# Altium schematic sheet CYV15G0403.SchDoc: Cypress Molson - CYV15G0403
size B; CompanyName: Linear Systems Ltd.; DrawnBy: G. Cosens; Engineer: G. Cosens; Organization: Linear Systems Ltd.; Address1: 1717 Dublin Avenue, Unit 1; Address2: Winnipeg, MB, Canada; Address3: R3H 0H2; DocumentNumber: LS7652; Revision: 1; SheetNumber: 08; SheetTotal: 12
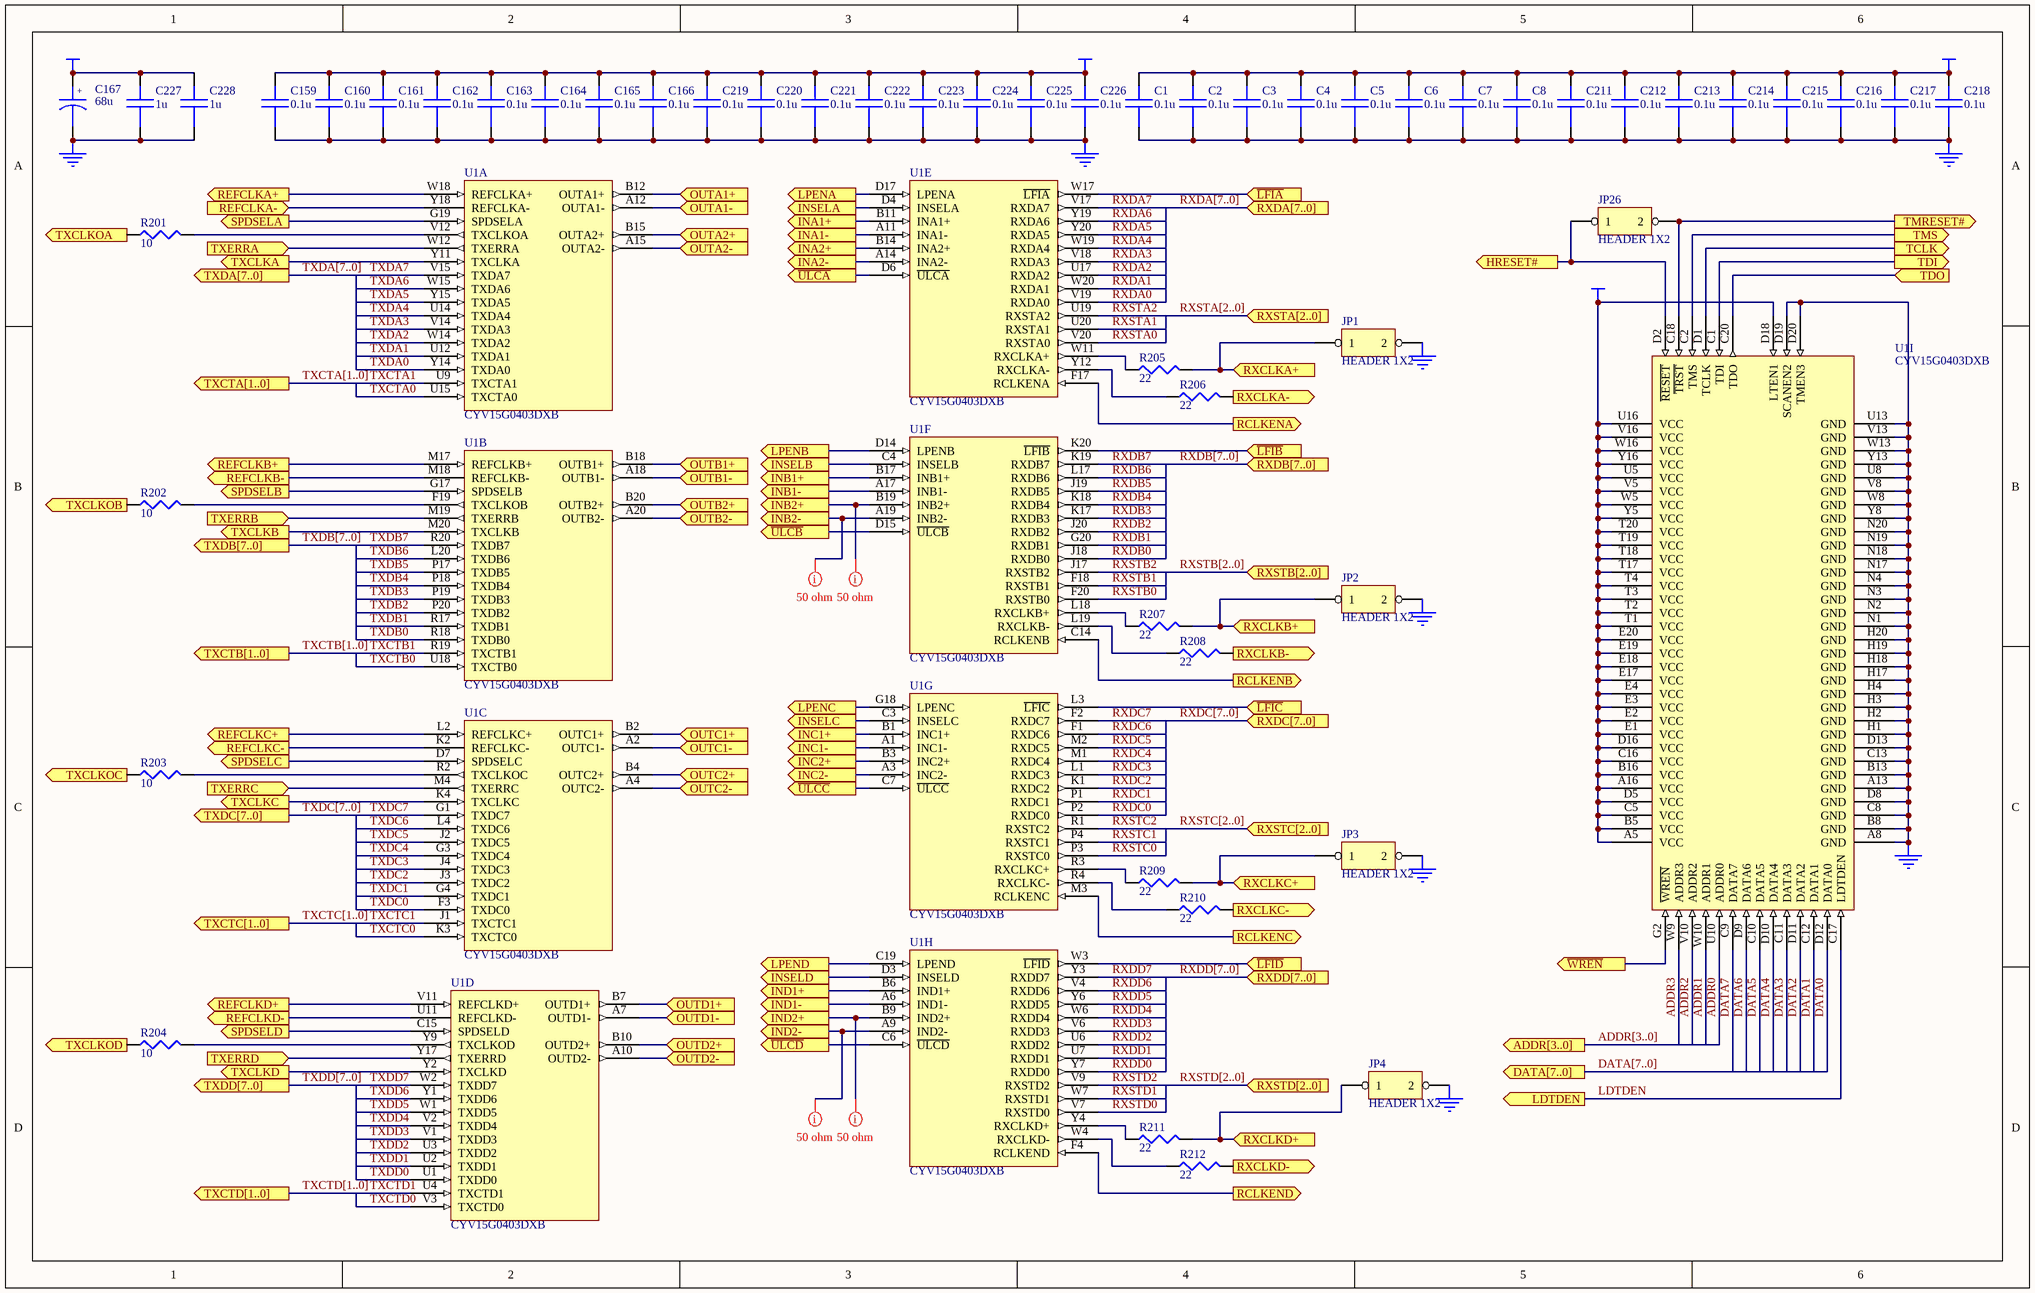
[diagram p0: CYV15G0403.SchDoc]

## Parts
C1  (no value)  [0603]
C2  (no value)  [0603]
C3  (no value)  [0603]
C4  (no value)  [0603]
C5  (no value)  [0603]
C6  (no value)  [0603]
C7  (no value)  [0603]
C8  (no value)  [0603]
C159  (no value)  [0603]
C160  (no value)  [0603]
C161  (no value)  [0603]
C162  (no value)  [0603]
C163  (no value)  [0603]
C164  (no value)  [0603]
C165  (no value)  [0603]
C166  (no value)  [0603]
C167  68u  [6032]
C211  (no value)  [0603]
C212  (no value)  [0603]
C213  (no value)  [0603]
C214  (no value)  [0603]
C215  (no value)  [0603]
C216  (no value)  [0603]
C217  (no value)  [0603]
C218  (no value)  [0603]
C219  (no value)  [0603]
C220  (no value)  [0603]
C221  (no value)  [0603]
C222  (no value)  [0603]
C223  (no value)  [0603]
C224  (no value)  [0603]
C225  (no value)  [0603]
C226  (no value)  [0603]
C227  (no value)  [0805]
C228  (no value)  [0805]
JP1  (no value)  [1X2PIN]
JP2  (no value)  [1X2PIN]
JP3  (no value)  [1X2PIN]
JP4  (no value)  [1X2PIN]
JP26  (no value)  [1X2PIN]
R201  10  [0603]
R202  10  [0603]
R203  10  [0603]
R204  10  [0603]
R205  22  [0603]
R206  22  [0603]
R207  22  [0603]
R208  22  [0603]
R209  22  [0603]
R210  22  [0603]
R211  22  [0603]
R212  22  [0603]
U1  CYV15G0403DXB  [BGA27X27-B256]  (parts A,B,C,D,E,F,G,H,I of 9)

## Ports
ADDR[3..0] (out), DATA[7..0] (out), HRESET# (out), INA1+ (out), INA1- (out), INA2+ (out), INA2- (out), INB1+ (out), INB1- (out), INB2+ (out), INB2- (out), INC1+ (out), INC1- (out), INC2+ (out), INC2- (out), IND1+ (out), IND1- (out), IND2+ (out), IND2- (out), INSELA (out), INSELB (out), INSELC (out), INSELD (out), LDTDEN (out), LPENA (out), LPENB (out), LPENC (out), LPEND (out), OUTA1+ (in), OUTA1- (in), OUTA2+ (in), OUTA2- (in), OUTB1+ (in), OUTB1- (in), OUTB2+ (in), OUTB2- (in), OUTC1+ (in), OUTC1- (in), OUTC2+ (in), OUTC2- (in), OUTD1+ (in), OUTD1- (in), OUTD2+ (in), OUTD2- (in), RCLKENA (out), RCLKENB (out), RCLKENC (out), RCLKEND (out), REFCLKA+ (out), REFCLKA- (in), REFCLKB+ (out), REFCLKB- (out), REFCLKC+ (out), REFCLKC- (out), REFCLKD+ (out), REFCLKD- (out), RXCLKA+ (in), RXCLKA- (in), RXCLKB+ (in), RXCLKB- (in), RXCLKC+ (in), RXCLKC- (in), RXCLKD+ (in), RXCLKD- (in), RXDA[7..0] (in), RXDB[7..0] (in), RXDC[7..0] (in), RXDD[7..0] (in), RXSTA[2..0] (in), RXSTB[2..0] (in), RXSTC[2..0] (in), RXSTD[2..0] (in), SPDSELA (out), SPDSELB (out), SPDSELC (out), SPDSELD (out), TCLK (out), TDI (out), TDO (in), TMRESET# (out), TMS (out), TXCLKA (out), TXCLKB (out), TXCLKC (out), TXCLKD (out), TXCLKOA (in), TXCLKOB (in), TXCLKOC (in), TXCLKOD (in), TXCTA[1..0] (out), TXCTB[1..0] (out), TXCTC[1..0] (out), TXCTD[1..0] (out), TXDA[7..0] (out), TXDB[7..0] (out), TXDC[7..0] (out), TXDD[7..0] (out), TXERRA (in), TXERRB (in), TXERRC (in), TXERRD (in), ~{LFIA} (in), ~{LFIB} (in), ~{LFIC} (in), ~{LFID} (in), ~{ULCA} (out), ~{ULCB} (out), ~{ULCC} (out), ~{ULCD} (out), ~{WREN} (out)

## Nets
+3.3V: C1.1 C2.1 C3.1 C4.1 C5.1 C6.1 C7.1 C8.1 C159.1 C160.1 C161.1 C162.1 C163.1 C164.1 C165.1 C166.1 C167.1 C211.1 C212.1 C213.1 C214.1 C215.1 C216.1 C217.1 C218.1 C219.1 C220.1 C221.1 C222.1 C223.1 C224.1 C225.1 C226.1 C227.1 C228.1 U1.A5(VCC) U1.A16(VCC) U1.B5(VCC) U1.B16(VCC) U1.C5(VCC) U1.C16(VCC) U1.D5(VCC) U1.D16(VCC) U1.D18(LTEN1) U1.E1(VCC) U1.E2(VCC) U1.E3(VCC) U1.E4(VCC) U1.E17(VCC) U1.E18(VCC) U1.E19(VCC) U1.E20(VCC) U1.T1(VCC) U1.T2(VCC) U1.T3(VCC) U1.T4(VCC) U1.T17(VCC) U1.T18(VCC) U1.T19(VCC) U1.T20(VCC) U1.U5(VCC) U1.U16(VCC) U1.V5(VCC) U1.V16(VCC) U1.W5(VCC) U1.W16(VCC) U1.Y5(VCC) U1.Y16(VCC)
GND: C1.2 C2.2 C3.2 C4.2 C5.2 C6.2 C7.2 C8.2 C159.2 C160.2 C161.2 C162.2 C163.2 C164.2 C165.2 C166.2 C167.2 C211.2 C212.2 C213.2 C214.2 C215.2 C216.2 C217.2 C218.2 C219.2 C220.2 C221.2 C222.2 C223.2 C224.2 C225.2 C226.2 C227.2 C228.2 JP1.2 JP2.2 JP3.2 JP4.2 U1.A8(GND) U1.A13(GND) U1.B8(GND) U1.B13(GND) U1.C8(GND) U1.C13(GND) U1.D8(GND) U1.D13(GND) U1.D19(SCANEN2) U1.D20(TMEN3) U1.H1(GND) U1.H2(GND) U1.H3(GND) U1.H4(GND) U1.H17(GND) U1.H18(GND) U1.H19(GND) U1.H20(GND) U1.N1(GND) U1.N2(GND) U1.N3(GND) U1.N4(GND) U1.N17(GND) U1.N18(GND) U1.N19(GND) U1.N20(GND) U1.U8(GND) U1.U13(GND) U1.V8(GND) U1.V13(GND) U1.W8(GND) U1.W13(GND) U1.Y8(GND) U1.Y13(GND)
ADDR0: U1.U10(ADDR0)
ADDR1: U1.W10(ADDR1)
ADDR2: U1.V10(ADDR2)
ADDR3: U1.W9(ADDR3)
DATA0: U1.D12(DATA0)
DATA1: U1.C12(DATA1)
DATA2: U1.D11(DATA2)
DATA3: U1.C11(DATA3)
DATA4: U1.D10(DATA4)
DATA5: U1.C10(DATA5)
DATA6: U1.D9(DATA6)
DATA7: U1.C9(DATA7)
HRESET#: JP26.1 U1.D2(~{RESET}) ; port HRESET#
INA1+: U1.B11(INA1+) ; port INA1+
INA1-: U1.A11(INA1-) ; port INA1-
INA2+: U1.B14(INA2+) ; port INA2+
INA2-: U1.A14(INA2-) ; port INA2-
INB1+: U1.B17(INB1+) ; port INB1+
INB1-: U1.A17(INB1-) ; port INB1-
INB2+: U1.B19(INB2+) ; port INB2+
INB2-: U1.A19(INB2-) ; port INB2-
INC1+: U1.B1(INC1+) ; port INC1+
INC1-: U1.A1(INC1-) ; port INC1-
INC2+: U1.B3(INC2+) ; port INC2+
INC2-: U1.A3(INC2-) ; port INC2-
IND1+: U1.B6(IND1+) ; port IND1+
IND1-: U1.A6(IND1-) ; port IND1-
IND2+: U1.B9(IND2+) ; port IND2+
IND2-: U1.A9(IND2-) ; port IND2-
INSELA: U1.D4(INSELA) ; port INSELA
INSELB: U1.C4(INSELB) ; port INSELB
INSELC: U1.C3(INSELC) ; port INSELC
INSELD: U1.D3(INSELD) ; port INSELD
~{LFIA}: U1.W17(~{LFIA}) ; port ~{LFIA}
~{LFIB}: U1.K20(~{LFIB}) ; port ~{LFIB}
~{LFIC}: U1.L3(~{LFIC}) ; port ~{LFIC}
~{LFID}: U1.W3(~{LFID}) ; port ~{LFID}
LDTDEN: U1.C17(LDTDEN) ; port LDTDEN
LPENA: U1.D17(LPENA) ; port LPENA
LPENB: U1.D14(LPENB) ; port LPENB
LPENC: U1.G18(LPENC) ; port LPENC
LPEND: U1.C19(LPEND) ; port LPEND
OUTA1+: U1.B12(OUTA1+) ; port OUTA1+
OUTA1-: U1.A12(OUTA1-) ; port OUTA1-
OUTA2+: U1.B15(OUTA2+) ; port OUTA2+
OUTA2-: U1.A15(OUTA2-) ; port OUTA2-
OUTB1+: U1.B18(OUTB1+) ; port OUTB1+
OUTB1-: U1.A18(OUTB1-) ; port OUTB1-
OUTB2+: U1.B20(OUTB2+) ; port OUTB2+
OUTB2-: U1.A20(OUTB2-) ; port OUTB2-
OUTC1+: U1.B2(OUTC1+) ; port OUTC1+
OUTC1-: U1.A2(OUTC1-) ; port OUTC1-
OUTC2+: U1.B4(OUTC2+) ; port OUTC2+
OUTC2-: U1.A4(OUTC2-) ; port OUTC2-
OUTD1+: U1.B7(OUTD1+) ; port OUTD1+
OUTD1-: U1.A7(OUTD1-) ; port OUTD1-
OUTD2+: U1.B10(OUTD2+) ; port OUTD2+
OUTD2-: U1.A10(OUTD2-) ; port OUTD2-
RCLKENA: U1.F17(RCLKENA) ; port RCLKENA
RCLKENB: U1.C14(RCLKENB) ; port RCLKENB
RCLKENC: U1.M3(RCLKENC) ; port RCLKENC
RCLKEND: U1.F4(RCLKEND) ; port RCLKEND
REFCLKA+: U1.W18(REFCLKA+) ; port REFCLKA+
REFCLKA-: U1.Y18(REFCLKA-) ; port REFCLKA-
REFCLKB+: U1.M17(REFCLKB+) ; port REFCLKB+
REFCLKB-: U1.M18(REFCLKB-) ; port REFCLKB-
REFCLKC+: U1.L2(REFCLKC+) ; port REFCLKC+
REFCLKC-: U1.K2(REFCLKC-) ; port REFCLKC-
REFCLKD+: U1.V11(REFCLKD+) ; port REFCLKD+
REFCLKD-: U1.U11(REFCLKD-) ; port REFCLKD-
RXCLKA+: JP1.1 R205.2 ; port RXCLKA+
RXCLKA-: R206.2 ; port RXCLKA-
RXCLKB+: JP2.1 R207.2 ; port RXCLKB+
RXCLKB-: R208.2 ; port RXCLKB-
RXCLKC+: JP3.1 R209.2 ; port RXCLKC+
RXCLKC-: R210.2 ; port RXCLKC-
RXCLKD+: JP4.1 R211.2 ; port RXCLKD+
RXCLKD-: R212.2 ; port RXCLKD-
RXDA0: U1.V19(RXDA0)
RXDA1: U1.W20(RXDA1)
RXDA2: U1.U17(RXDA2)
RXDA3: U1.V18(RXDA3)
RXDA4: U1.W19(RXDA4)
RXDA5: U1.Y20(RXDA5)
RXDA6: U1.Y19(RXDA6)
RXDA7: U1.V17(RXDA7)
RXDB0: U1.J18(RXDB0)
RXDB1: U1.G20(RXDB1)
RXDB2: U1.J20(RXDB2)
RXDB3: U1.K17(RXDB3)
RXDB4: U1.K18(RXDB4)
RXDB5: U1.J19(RXDB5)
RXDB6: U1.L17(RXDB6)
RXDB7: U1.K19(RXDB7)
RXDC0: U1.P2(RXDC0)
RXDC1: U1.P1(RXDC1)
RXDC2: U1.K1(RXDC2)
RXDC3: U1.L1(RXDC3)
RXDC4: U1.M1(RXDC4)
RXDC5: U1.M2(RXDC5)
RXDC6: U1.F1(RXDC6)
RXDC7: U1.F2(RXDC7)
RXDD0: U1.Y7(RXDD0)
RXDD1: U1.U7(RXDD1)
RXDD2: U1.U6(RXDD2)
RXDD3: U1.V6(RXDD3)
RXDD4: U1.W6(RXDD4)
RXDD5: U1.Y6(RXDD5)
RXDD6: U1.V4(RXDD6)
RXDD7: U1.Y3(RXDD7)
RXSTA0: U1.V20(RXSTA0)
RXSTA1: U1.U20(RXSTA1)
RXSTA2: U1.U19(RXSTA2)
RXSTB0: U1.F20(RXSTB0)
RXSTB1: U1.F18(RXSTB1)
RXSTB2: U1.J17(RXSTB2)
RXSTC0: U1.P3(RXSTC0)
RXSTC1: U1.P4(RXSTC1)
RXSTC2: U1.R1(RXSTC2)
RXSTD0: U1.V7(RXSTD0)
RXSTD1: U1.W7(RXSTD1)
RXSTD2: U1.V9(RXSTD2)
SPDSELA: U1.G19(SPDSELA) ; port SPDSELA
SPDSELB: U1.G17(SPDSELB) ; port SPDSELB
SPDSELC: U1.D7(SPDSELC) ; port SPDSELC
SPDSELD: U1.C15(SPDSELD) ; port SPDSELD
TCLK: U1.D1(TCLK) ; port TCLK
TDI: U1.C1(TDI) ; port TDI
TDO: U1.C20(TDO) ; port TDO
TMRESET#: JP26.2 U1.C18(~{TRST}) ; port TMRESET#
TMS: U1.C2(TMS) ; port TMS
TXCLKA: U1.Y11(TXCLKA) ; port TXCLKA
TXCLKB: U1.M20(TXCLKB) ; port TXCLKB
TXCLKC: U1.K4(TXCLKC) ; port TXCLKC
TXCLKD: U1.Y2(TXCLKD) ; port TXCLKD
TXCLKOA: R201.1 ; port TXCLKOA
TXCLKOB: R202.1 ; port TXCLKOB
TXCLKOC: R203.1 ; port TXCLKOC
TXCLKOD: R204.1 ; port TXCLKOD
TXCTA0: U1.U15(TXCTA0)
TXCTA1: U1.U9(TXCTA1)
TXCTB0: U1.U18(TXCTB0)
TXCTB1: U1.R19(TXCTB1)
TXCTC0: U1.K3(TXCTC0)
TXCTC1: U1.J1(TXCTC1)
TXCTD0: U1.V3(TXCTD0)
TXCTD1: U1.U4(TXCTD1)
TXDA0: U1.Y14(TXDA0)
TXDA1: U1.U12(TXDA1)
TXDA2: U1.W14(TXDA2)
TXDA3: U1.V14(TXDA3)
TXDA4: U1.U14(TXDA4)
TXDA5: U1.Y15(TXDA5)
TXDA6: U1.W15(TXDA6)
TXDA7: U1.V15(TXDA7)
TXDB0: U1.R18(TXDB0)
TXDB1: U1.R17(TXDB1)
TXDB2: U1.P20(TXDB2)
TXDB3: U1.P19(TXDB3)
TXDB4: U1.P18(TXDB4)
TXDB5: U1.P17(TXDB5)
TXDB6: U1.L20(TXDB6)
TXDB7: U1.R20(TXDB7)
TXDC0: U1.F3(TXDC0)
TXDC1: U1.G4(TXDC1)
TXDC2: U1.J3(TXDC2)
TXDC3: U1.J4(TXDC3)
TXDC4: U1.G3(TXDC4)
TXDC5: U1.J2(TXDC5)
TXDC6: U1.L4(TXDC6)
TXDC7: U1.G1(TXDC7)
TXDD0: U1.U1(TXDD0)
TXDD1: U1.U2(TXDD1)
TXDD2: U1.U3(TXDD2)
TXDD3: U1.V1(TXDD3)
TXDD4: U1.V2(TXDD4)
TXDD5: U1.W1(TXDD5)
TXDD6: U1.Y1(TXDD6)
TXDD7: U1.W2(TXDD7)
TXERRA: U1.W12(TXERRA) ; port TXERRA
TXERRB: U1.M19(TXERRB) ; port TXERRB
TXERRC: U1.M4(TXERRC) ; port TXERRC
TXERRD: U1.Y17(TXERRD) ; port TXERRD
~{ULCA}: U1.D6(~{ULCA}) ; port ~{ULCA}
~{ULCB}: U1.D15(~{ULCB}) ; port ~{ULCB}
~{ULCC}: U1.C7(~{ULCC}) ; port ~{ULCC}
~{ULCD}: U1.C6(~{ULCD}) ; port ~{ULCD}
~{WREN}: U1.G2(~{WREN}) ; port ~{WREN}
NetR201_2: R201.2 U1.V12(TXCLKOA)
NetR202_2: R202.2 U1.F19(TXCLKOB)
NetR203_2: R203.2 U1.R2(TXCLKOC)
NetR204_2: R204.2 U1.Y9(TXCLKOD)
NetR205_1: R205.1 U1.W11(RXCLKA+)
NetR206_1: R206.1 U1.Y12(RXCLKA-)
NetR207_1: R207.1 U1.L18(RXCLKB+)
NetR208_1: R208.1 U1.L19(RXCLKB-)
NetR209_1: R209.1 U1.R3(RXCLKC+)
NetR210_1: R210.1 U1.R4(RXCLKC-)
NetR211_1: R211.1 U1.Y4(RXCLKD+)
NetR212_1: R212.1 U1.W4(RXCLKD-)

## Buses and harness runs
bus ADDR[3..0] = port ADDR[3..0]
bus DATA[7..0] = port DATA[7..0]
bus RXDA[7..0] = port RXDA[7..0]
bus RXDB[7..0] = port RXDB[7..0]
bus RXDC[7..0] = port RXDC[7..0]
bus RXDD[7..0] = port RXDD[7..0]
bus RXSTA[2..0] = port RXSTA[2..0]
bus RXSTB[2..0] = port RXSTB[2..0]
bus RXSTC[2..0] = port RXSTC[2..0]
bus RXSTD[2..0] = port RXSTD[2..0]
bus TXCTA[1..0] = port TXCTA[1..0]
bus TXCTB[1..0] = port TXCTB[1..0]
bus TXCTC[1..0] = port TXCTC[1..0]
bus TXCTD[1..0] = port TXCTD[1..0]
bus TXDA[7..0] = port TXDA[7..0]
bus TXDB[7..0] = port TXDB[7..0]
bus TXDC[7..0] = port TXDC[7..0]
bus TXDD[7..0] = port TXDD[7..0]

## Layout directives
rule Width Constraint [Pref Width = 10mil    Min Width = 10mil    Max Width = 10mil]: INB2+, INB2-, IND2+, IND2-

## Notes on the sheet
- Size
- Date:
- B
- Drawing Number
- Sheet
- Revision
- of
- File:
- Drawn By:
- G. Cosens
- (in symbol CAPACITOR POL) +

## Library data of the parts
C1-C8 C159-C166 C211-C228 = CAP: SMT CAP
C167 = CAPACITOR POL: Text Field1: 20; Text Field2: 20
JP1-JP4 JP26 = HEADER 1X2: Text Field1: 40; Text Field2: 60
R201-R212 = RES1